# Altium schematic sheet PSU.SchDoc
size A4; SheetNumber: 5; SheetTotal: 8
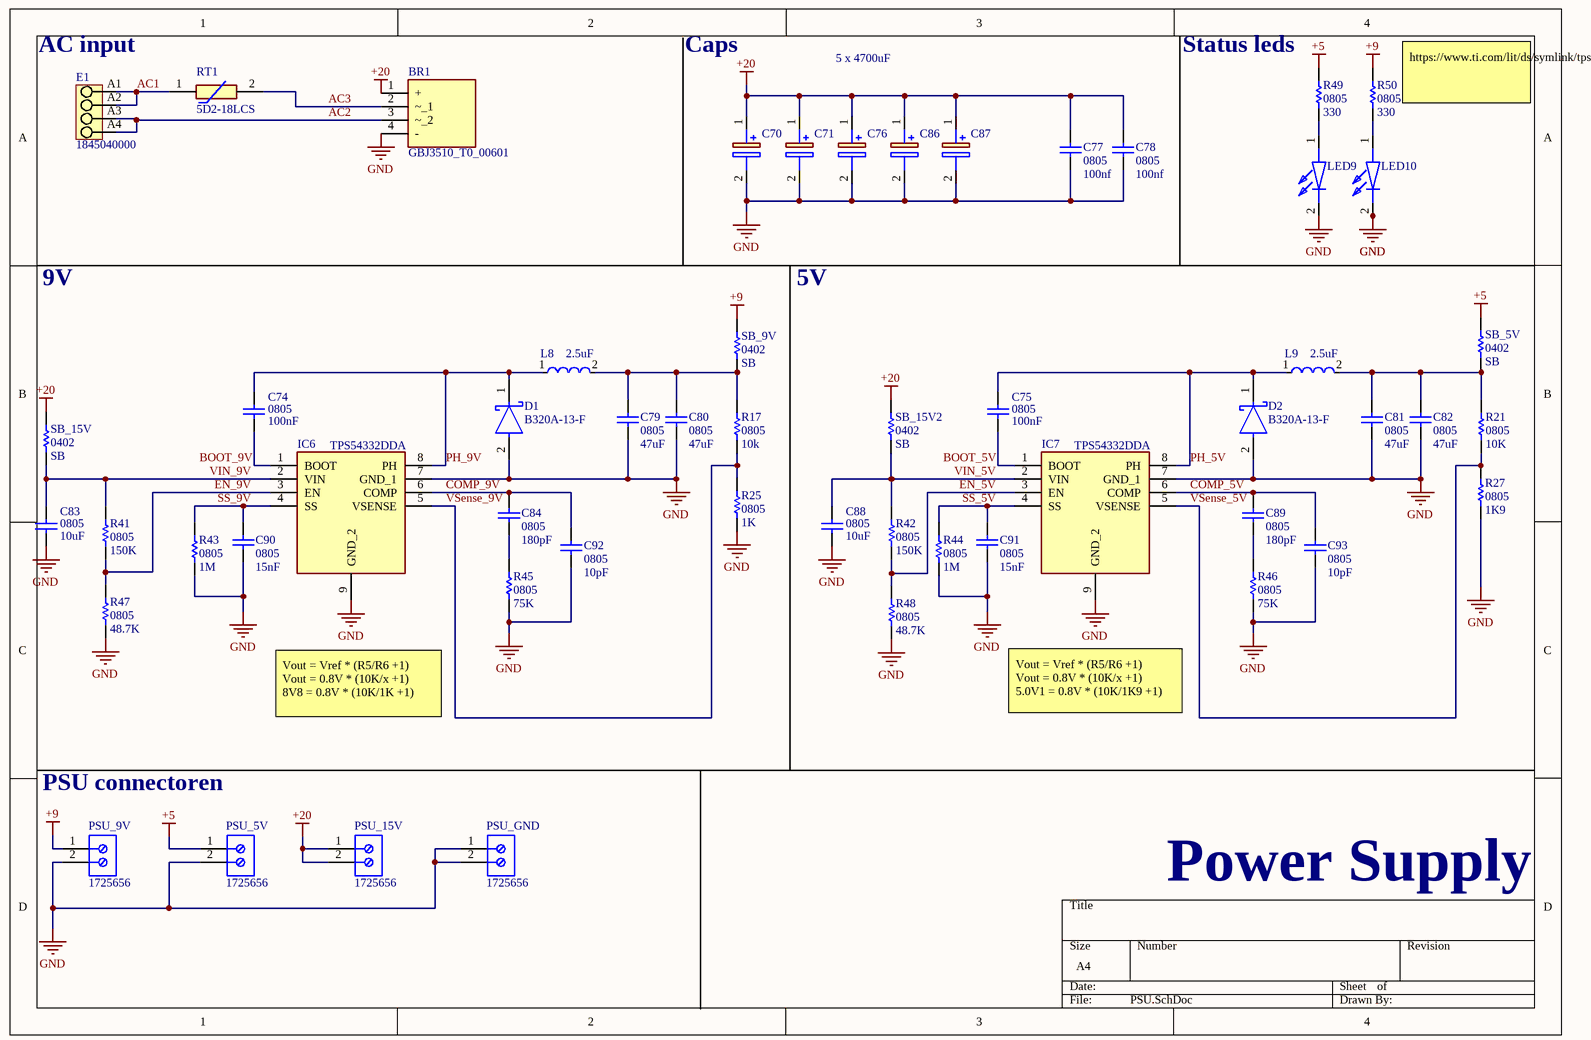
[diagram p0: PSU.SchDoc]

## Parts
BR1  GBJ3510_T0_00601  [GBJ3510_T0_00601]
C70  UFW1V472MHD  [CAPPRD750W80D1825H3750]  (value not drawn)
C71  UFW1V472MHD  [CAPPRD750W80D1825H3750]  (value not drawn)
C74  0805  value 100nF  [6-0805_N]
C75  0805  value 100nF  [6-0805_N]
C76  UFW1V472MHD  [CAPPRD750W80D1825H3750]  (value not drawn)
C77  0805  value 100nf  [6-0805_N]
C78  0805  value 100nf  [6-0805_N]
C79  0805  value 47uF  [6-0805_N]
C80  0805  value 47uF  [6-0805_N]
C81  0805  value 47uF  [6-0805_N]
C82  0805  value 47uF  [6-0805_N]
C83  0805  value 10uF  [6-0805_N]
C84  0805  value 180pF  [6-0805_N]
C86  UFW1V472MHD  [CAPPRD750W80D1825H3750]  (value not drawn)
C87  UFW1V472MHD  [CAPPRD750W80D1825H3750]  (value not drawn)
C88  0805  value 10uF  [6-0805_N]
C89  0805  value 180pF  [6-0805_N]
C90  0805  value 15nF  [6-0805_N]
C91  0805  value 15nF  [6-0805_N]
C92  0805  value 10pF  [6-0805_N]
C93  0805  value 10pF  [6-0805_N]
D1  B320A-13-F  [FP-SMA-MFG]
D2  B320A-13-F  [FP-SMA-MFG]
E1  1845040000  [LM_3_5_90_04]
IC6  TPS54332DDA  [SOIC127P600X170-9N]
IC7  TPS54332DDA  [SOIC127P600X170-9N]
L8  2.5uF  [710-74437346025]
L9  2.5uF  [710-74437346025]
LED9  ELM70303GD  [ELM70303GD]  (value not drawn)
LED10  ELM70303GD  [ELM70303GD]  (value not drawn)
PSU_5V  1725656  [PHOE-1725656-2]
PSU_9V  1725656  [PHOE-1725656-2]
PSU_15V  1725656  [PHOE-1725656-2]
PSU_GND  1725656  [PHOE-1725656-2]
R17  0805  value 10k  [6-0805_N]
R21  0805  value 10K  [6-0805_N]
R25  0805  value 1K  [6-0805_N]
R27  0805  value 1K9  [6-0805_N]
R41  0805  value 150K  [6-0805_N]
R42  0805  value 150K  [6-0805_N]
R43  0805  value 1M  [6-0805_N]
R44  0805  value 1M  [6-0805_N]
R45  0805  value 75K  [6-0805_N]
R46  0805  value 75K  [6-0805_N]
R47  0805  value 48.7K  [6-0805_N]
R48  0805  value 48.7K  [6-0805_N]
R49  0805  value 330  [6-0805_N]
R50  0805  value 330  [6-0805_N]
RT1  5D2-18LCS  [5D218LCS]
SB_5V  0402  value SB  [0402]
SB_9V  0402  value SB  [0402]
SB_15V  0402  value SB  [0402]
SB_15V2  0402  value SB  [0402]

## Nets
+5: PSU_5V.1 R49.1 SB_5V.1
+9: PSU_9V.1 R50.1 SB_9V.2
+20: BR1.1(+) C70.1(+) C71.1(+) C76.1(+) C77.1 C78.1 C86.1(+) C87.1(+) PSU_15V.1 PSU_15V.2 SB_15V.1 SB_15V2.2
GND: BR1.4(-) C70.2(-) C71.2(-) C76.2(-) C77.2 C78.2 C79.1 C80.1 C81.1 C82.1 C83.1 C86.2(-) C87.2(-) C88.1 C90.1 C91.1 C92.1 C93.1 D1.2(A) D2.2(A) IC6.7(GND_1) IC6.9(GND_2) IC7.7(GND_1) IC7.9(GND_2) LED9.2(K) LED10.2(K) PSU_5V.2 PSU_9V.2 PSU_GND.1 PSU_GND.2 R25.2 R27.2 R43.2 R44.2 R45.2 R46.2 R47.2 R48.2
AC1: E1.A1 E1.A2 RT1.1
AC2: BR1.3(~_2) E1.A3 E1.A4
AC3: BR1.2(~_1) RT1.2
BOOT_5V: C75.1 IC7.1(BOOT)
BOOT_9V: C74.1 IC6.1(BOOT)
COMP_5V: C89.2 C93.2 IC7.6(COMP)
COMP_9V: C84.2 C92.2 IC6.6(COMP)
EN_5V: IC7.3(EN) R42.2 R48.1
EN_9V: IC6.3(EN) R41.2 R47.1
PH_5V: C75.2 D2.1(C) IC7.8(PH) L9.1
PH_9V: C74.2 D1.1(C) IC6.8(PH) L8.1
SS_5V: C91.2 IC7.4(SS) R44.1
SS_9V: C90.2 IC6.4(SS) R43.1
VIN_5V: C88.2 IC7.2(VIN) R42.1 SB_15V2.1
VIN_9V: C83.2 IC6.2(VIN) R41.1 SB_15V.2
VSense_5V: IC7.5(VSENSE) R21.2 R27.1
VSense_9V: IC6.5(VSENSE) R17.2 R25.1
NetC79_2: C79.2 C80.2 L8.2 R17.1 SB_9V.1
NetC81_2: C81.2 C82.2 L9.2 R21.1 SB_5V.2
NetC84_1: C84.1 R45.1
NetC89_1: C89.1 R46.1
NetLED9_1: LED9.1(A) R49.2
NetLED10_1: LED10.1(A) R50.2

## Notes on the sheet
- (near E1) AC input
- Caps
- 5 x 4700uF
- (near R49) Status leds
- (near R50) https://www.ti.com/lit/ds/symlink/tps54332.pdf?HQS=dis-mous-null-mousermode-dsf-pf-null-wwe&ts=1676549637763&ref_url=https%253A%252F%252Fwww.mouser.de%252F
- 9V
- 5V
- Vout = Vref * (R5/R6 +1)
  Vout = 0.8V * (10K/x +1)
  8V8 = 0.8V * (10K/1K +1)
- Vout = Vref * (R5/R6 +1)
  Vout = 0.8V * (10K/x +1)
  5.0V1 = 0.8V * (10K/1K9 +1)
- PSU connectoren
- Power Supply

## Library data of the parts
BR1 = GBJ3510_T0_00601: Bridge Rectifier; Manufacturer_Name: PANJIT; Datasheet Link: https://www.panjit.com.tw/upload/datasheet/GBJ3510.pdf; Height: 24.6mm; Manufacturer_Part_Number: GBJ3510_T0_00601; Mouser Part Number: 241-GBJ3510_T0_00601; Mouser Price/Stock: https://www.mouser.co.uk/ProductDetail/Panjit/GBJ3510_T0_00601?qs=tlsG%2FOw5FFggsibJfWBTvQ%3D%3D
C70 C71 C76 C86 C87 = UFW1V472MHD: Capacitor Polarised; Manufacturer_Name: Nichicon; Datasheet Link: https://www.nichicon.co.jp/english/products/pdfs/e-ufw.pdf; Height: 37.5mm; Manufacturer_Part_Number: UFW1V472MHD; Mouser Part Number: 647-UFW1V472MHD; Mouser Price/Stock: https://www.mouser.co.uk/ProductDetail/Nichicon/UFW1V472MHD?qs=kArNe9LFxXnJL9rvReZXrQ%3D%3D; Arrow Part Number: UFW1V472MHD; Arrow Price/Stock: https://www.arrow.com/en/products/ufw1v472mhd/nichicon
C74 C75 C77-C84 C88-C93 = Cap: Capacitor; Published: 8-Jun-2000; LatestRevisionDate: 17-Jul-2002; LatestRevisionNote: Re-released for DXP Platform.; PackageReference: RAD-0.3; Publisher: Altium Limited; PackageDescription: Radial Cap, Thru-Hole; 2 Leads; 0.3 in Pin Spacing
D1 D2 = CMP-12790-000001-1: DIODE SCHOTTKY 20V 3A SMA; Manufacturer: Diodes Inc.; Peak Reverse Current: 0.5mA; Standoff Height: 0.05mm; Automotive Grade: Grade 0; Max Surge Forward Current: 80A; Value: 200pF; Max Junction Temp: +150°C; ComponentLink2Description: Datasheet; Forward Current: 3A; Height: 2.4mm; Temperature: -55°C to +150°C; Automotive: Yes; Temperature Range Low: -55°C; Lead Free: Yes; Digikey Description: DIODE SCHOTTKY 20V 3A SMA; Temperature Range High: +150°C; Reverse Voltage: 20V; Device Class L2: Diodes; Capacitance: 200pF; Manufacturer Part Number: B320A-13-F; Device Class L1: Discrete Semiconductors; RoHS: TRUE; Footprint Url: https://www.diodes.com/assets/Package-Files/SMA.pdf; Package: SMA; Category: Diode; ComponentLink2URL: https://www.diodes.com/assets/Datasheets/B320A_B360A.pdf; Mouser Description: Schottky Diodes & Rectifiers 20V 3A; Octopart: https://octopart.com/b320a-13-f-diodes+inc.-325803; Device Class L3: Schottky Diodes; Max Repetitive Reverse Voltage: 20V
E1 = CMP-1559-01732-1: OMNIMATE Signal - series LM; Manufacturer: Weidmueller; Rated_voltage_use_group_B_UL_1059: 300 V; Short_text_for_material: LM 3.50/04/90 3.2SN OR BX; Wire_cross_section_AWG_min_UL_1059: AWG 28; Pitch_mm: 3,5 mm; Solder_pin_length_mm: 3,2 mm; Contact_material: Cu-Leg; Rated_current_min_no_of_poles_TU_20_deg_C: 19 A; Rated_current_use_group_B_UL_1059: 10 A; Side_termination_characteristic: closed side; Contact_surface: tinned; UL_94_flammability_rating: V-2; Pitch_inch: 0,138 inch; Insulating_material: PA; Solid_max_H05_07_V_U: 1,5 mm²; Rated_voltage_for_surge_voltage_class_pollution_degree_II_2: 320 V; Wire_cross_section_AWG_max_UL_1059: AWG 14; Mounting_onto_the_PCB: Solder connection; Solid_min_H05_07_V_U: 0,5 mm²; No_of_poles: 4; ComponentLink2Description: URL Link1; ComponentLink2URL: http://catalog.weidmueller.com/catalog/Start.do?localeId=en&ObjectID=1845040000; Qty: 100 PCS; Packaging: Box; Revision: V1; PartNumber: 1845040000; ComponentLink1Description: Manufacturer URL; ComponentLink1URL: http://www.weidmueller.com/; PackageReference: LM_3_5_90_04; Colour: Orange
IC6 IC7 = TPS54332DDA: Integrated Circuit; Manufacturer_Name: Texas Instruments; Datasheet Link: http://www.ti.com/lit/ds/symlink/tps54332.pdf; Height: 1.7mm; Manufacturer_Part_Number: TPS54332DDA; Mouser Part Number: 595-TPS54332DDA; Mouser Price/Stock: https://www.mouser.co.uk/ProductDetail/Texas-Instruments/TPS54332DDA?qs=uxmOeTEqoPwp5rNW7uC%2FUw%3D%3D; Arrow Part Number: TPS54332DDA; Arrow Price/Stock: https://www.arrow.com/en/products/tps54332dda/texas-instruments?region=nac
L8 L9 = 710-74437346025: SMD
LED9 LED10 = ELM70303GD: LED; Manufacturer_Name: Bivar; Datasheet Link: https://componentsearchengine.com/Datasheets/2/ELM70303GD.pdf; Height: 5.4mm; Manufacturer_Part_Number: ELM70303GD; Mouser Part Number: 749-ELM70303GD; Mouser Price/Stock: https://www.mouser.co.uk/ProductDetail/Bivar/ELM70303GD?qs=RaByzyhmEWg099B9bvH9wg%3D%3D
PSU_5V PSU_9V PSU_15V PSU_GND = CMP-2000-05299-1: Male Header, Pitch 2.54 mm, 1 x 2 Position, Height 9 mm, Tail Length 3.5 mm; Manufacturer: Phoenix Contact; Number of contacts: 2; Content: 250pc(s); Pitch: 2.54mm; Industrial packaging: Yes; Colour: Green; Manufacturer part No.: 1725656; Type: MPT0,5/2-2,54; Datasheet URL: http://datasheet.octopart.com/1725656-Phoenix-Contact-datasheet-5302866.pdf; Manufacturer URL: http://www.phoenixcontact.com/; Datasheet Version: Apr-08
R17 R21 R25 R27 R41-R50 SB_5V SB_9V SB_15V SB_15V2 = Res1: Resistor; Published: 8-Jun-2000; LatestRevisionDate: 17-Jul-2002; LatestRevisionNote: Re-released for DXP Platform.; PackageReference: AXIAL-0.3; Publisher: Altium Limited; PackageDescription: Axial Device, Thru-Hole; 2 Leads; 0.3 in Pin Spacing
RT1 = 5D2-18LCS: Thermistor; Manufacturer_Name: Semitec; Datasheet Link: https://www.mouser.com/datasheet/2/362/powerthermistor-4812.pdf; Height: 23mm; Manufacturer_Part_Number: 5D2-18LCS; Mouser Part Number: 954-5D2-18LCS; Mouser Price/Stock: https://www.mouser.co.uk/ProductDetail/Semitec/5D2-18LCS?qs=wgO0AD0o1vtBHDxl69yjSQ%3D%3D